# Altium schematic sheet PCB_Michka_Ver0101.SchDoc
size A1
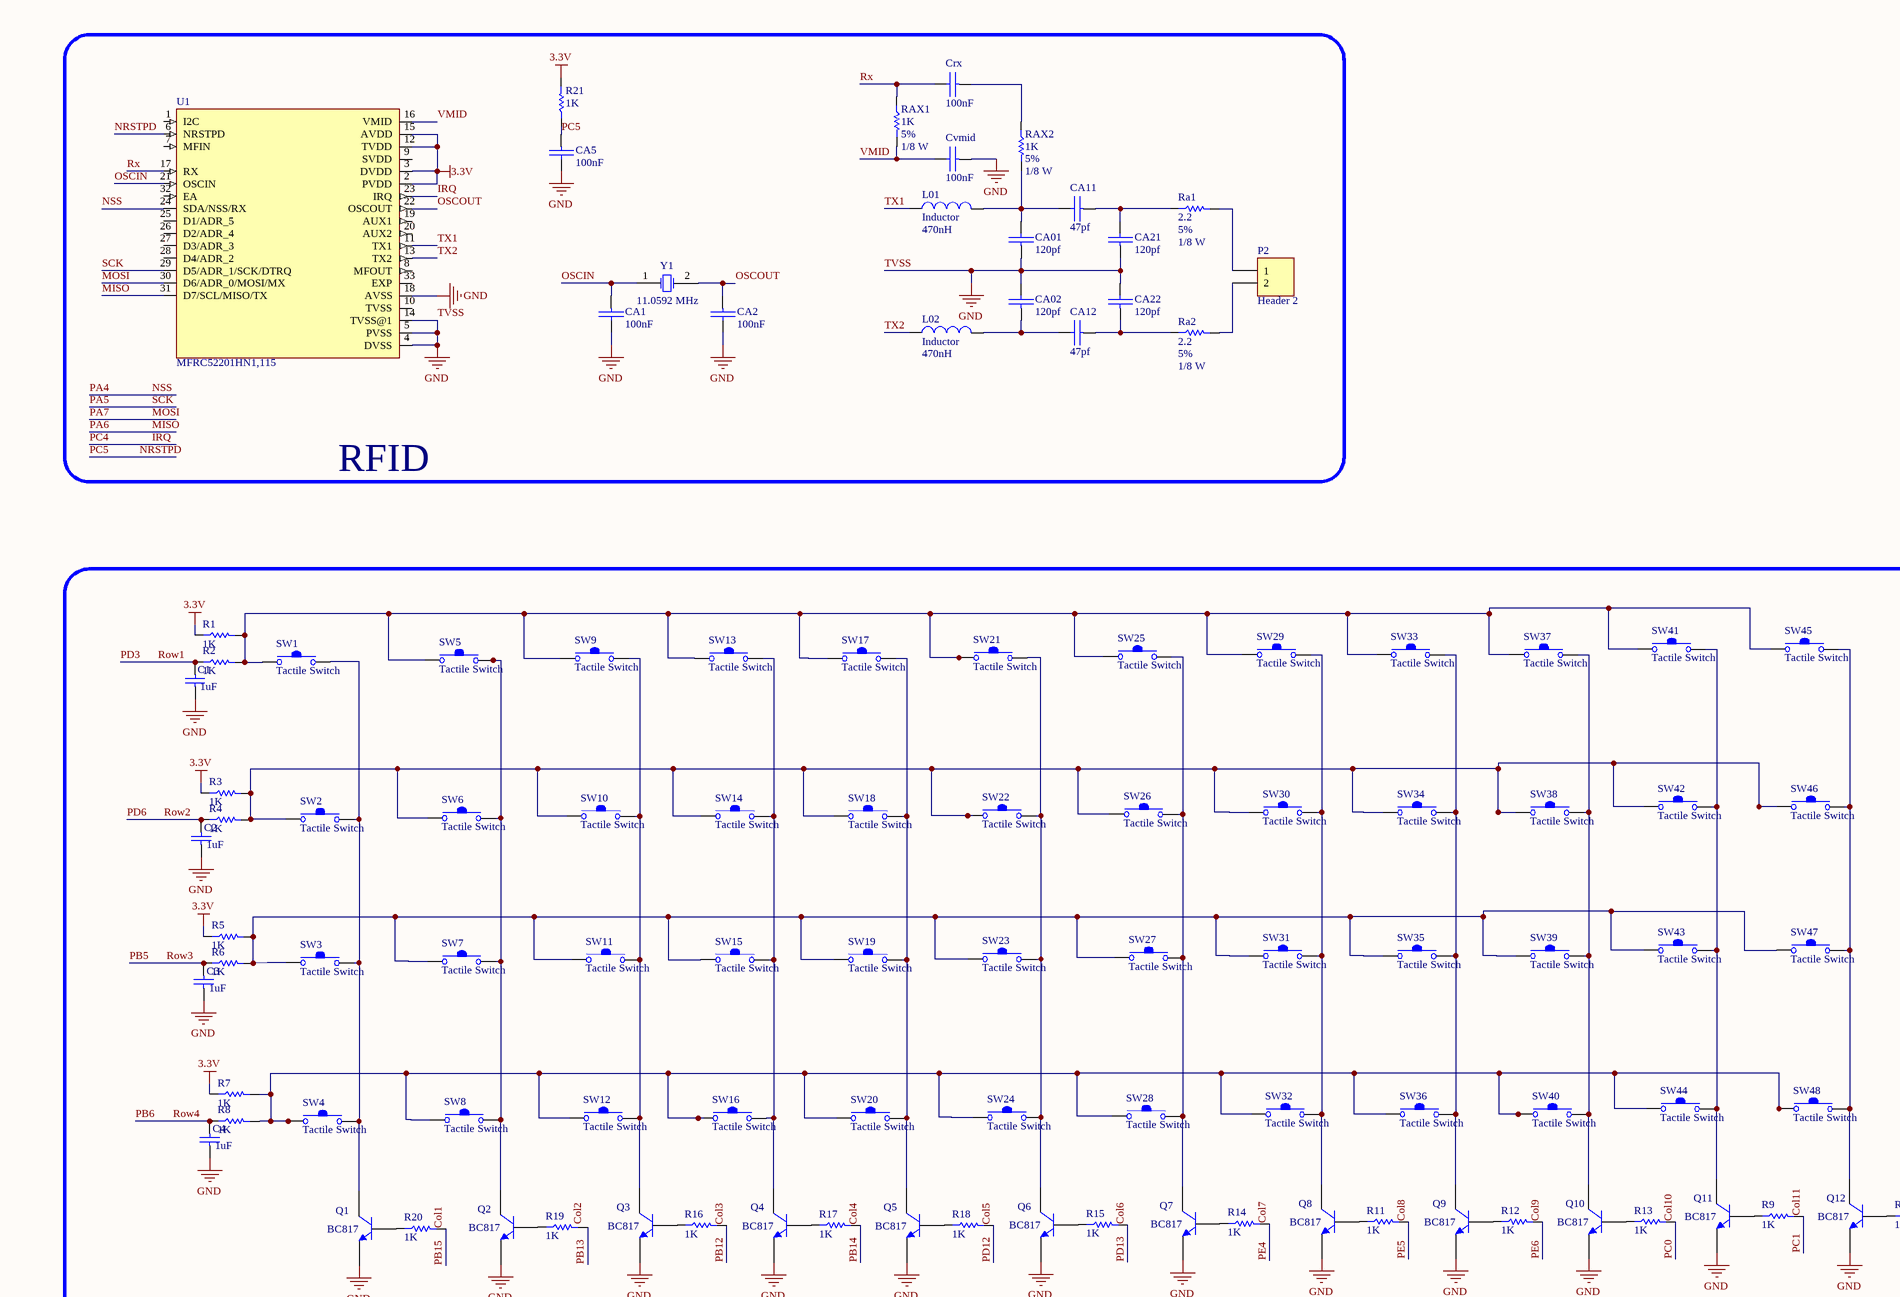
[diagram p0: PCB_Michka_Ver0101.SchDoc, top left]
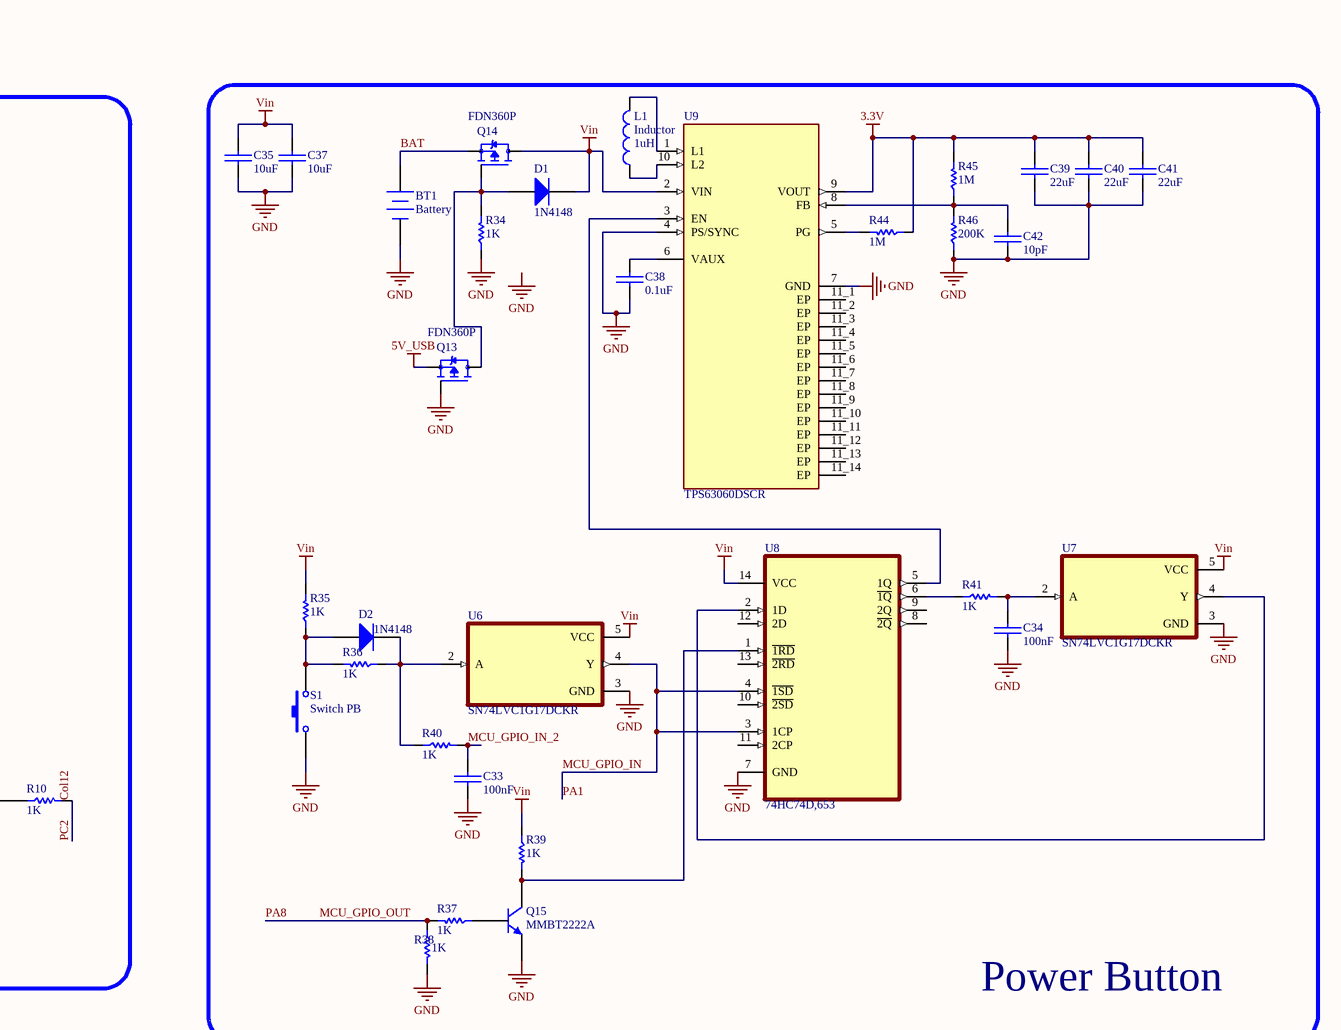
[diagram p1: PCB_Michka_Ver0101.SchDoc, top right]
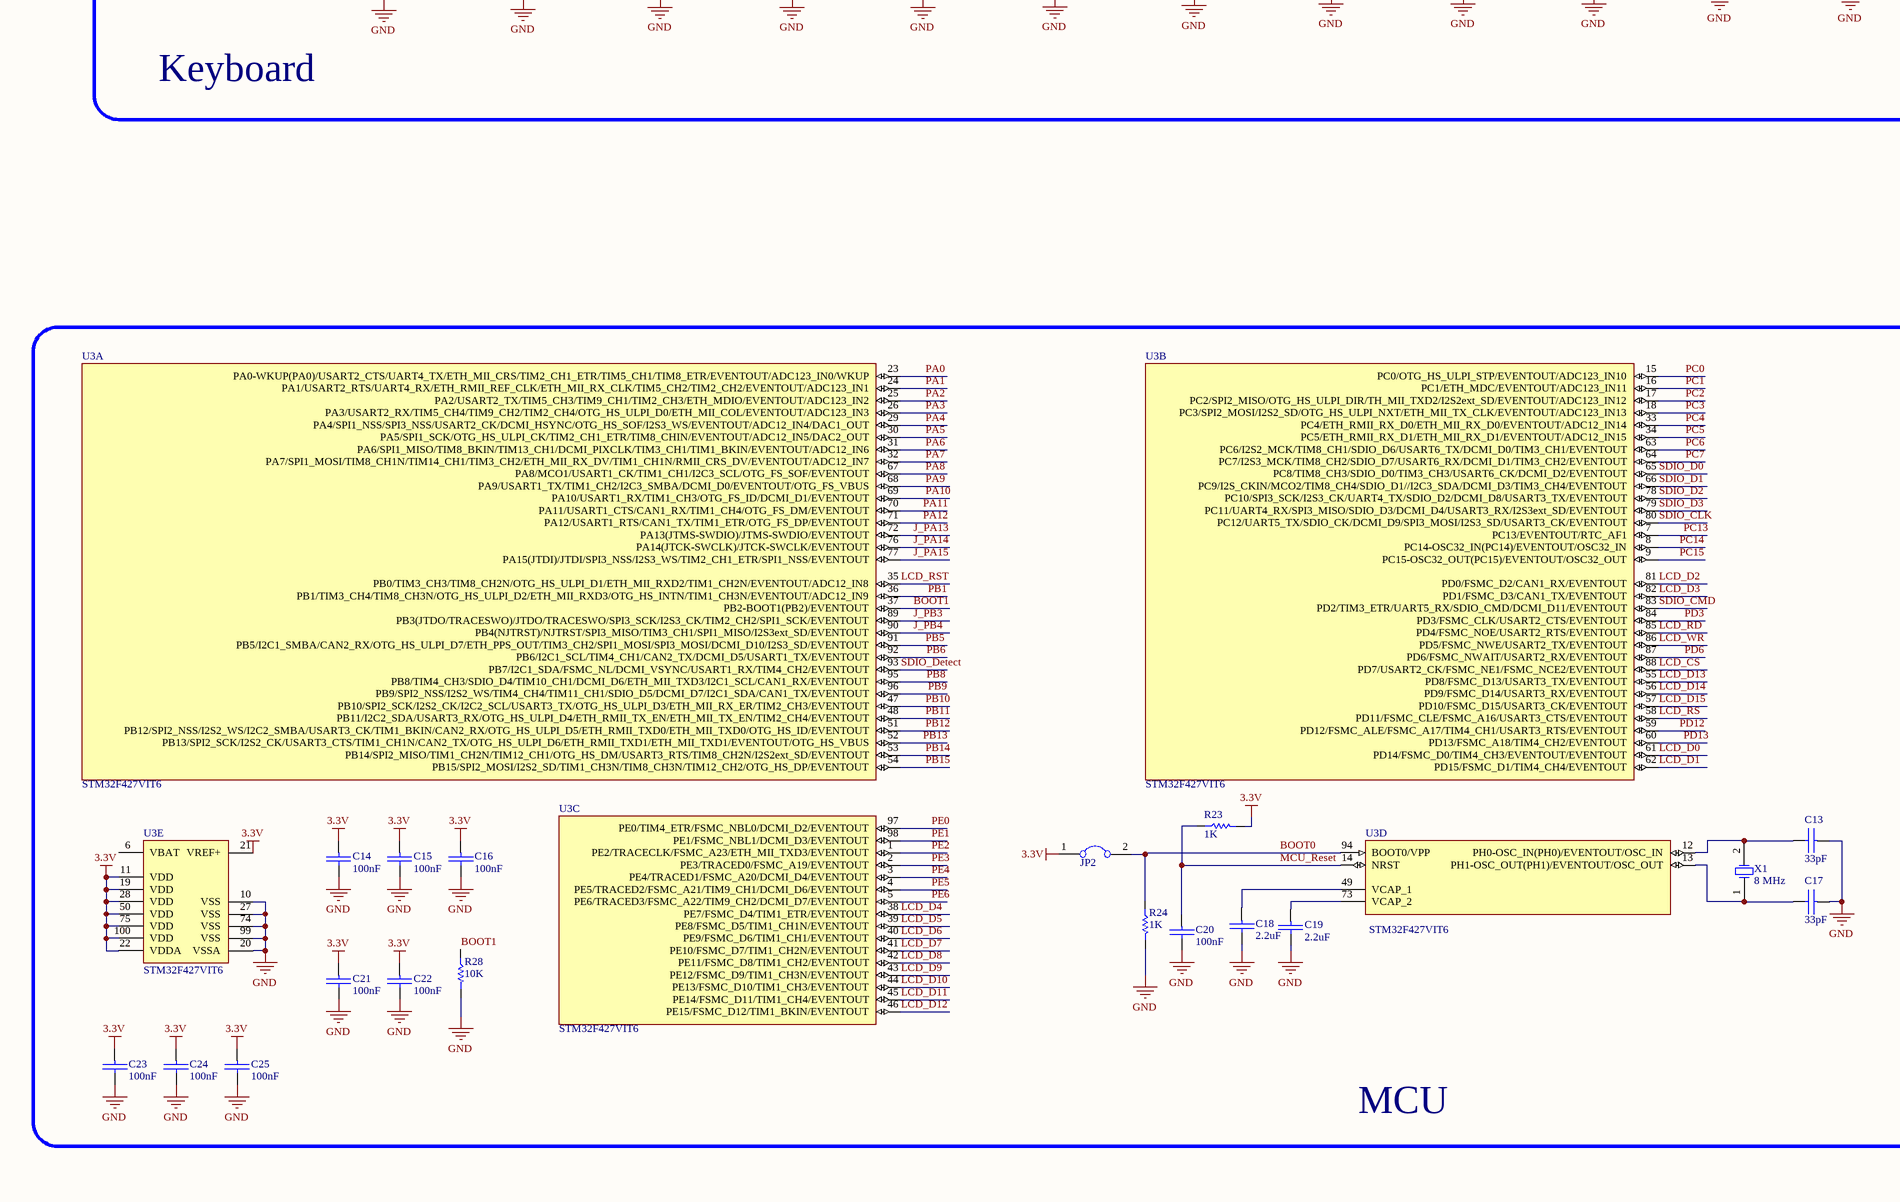
[diagram p2: PCB_Michka_Ver0101.SchDoc, bottom left]
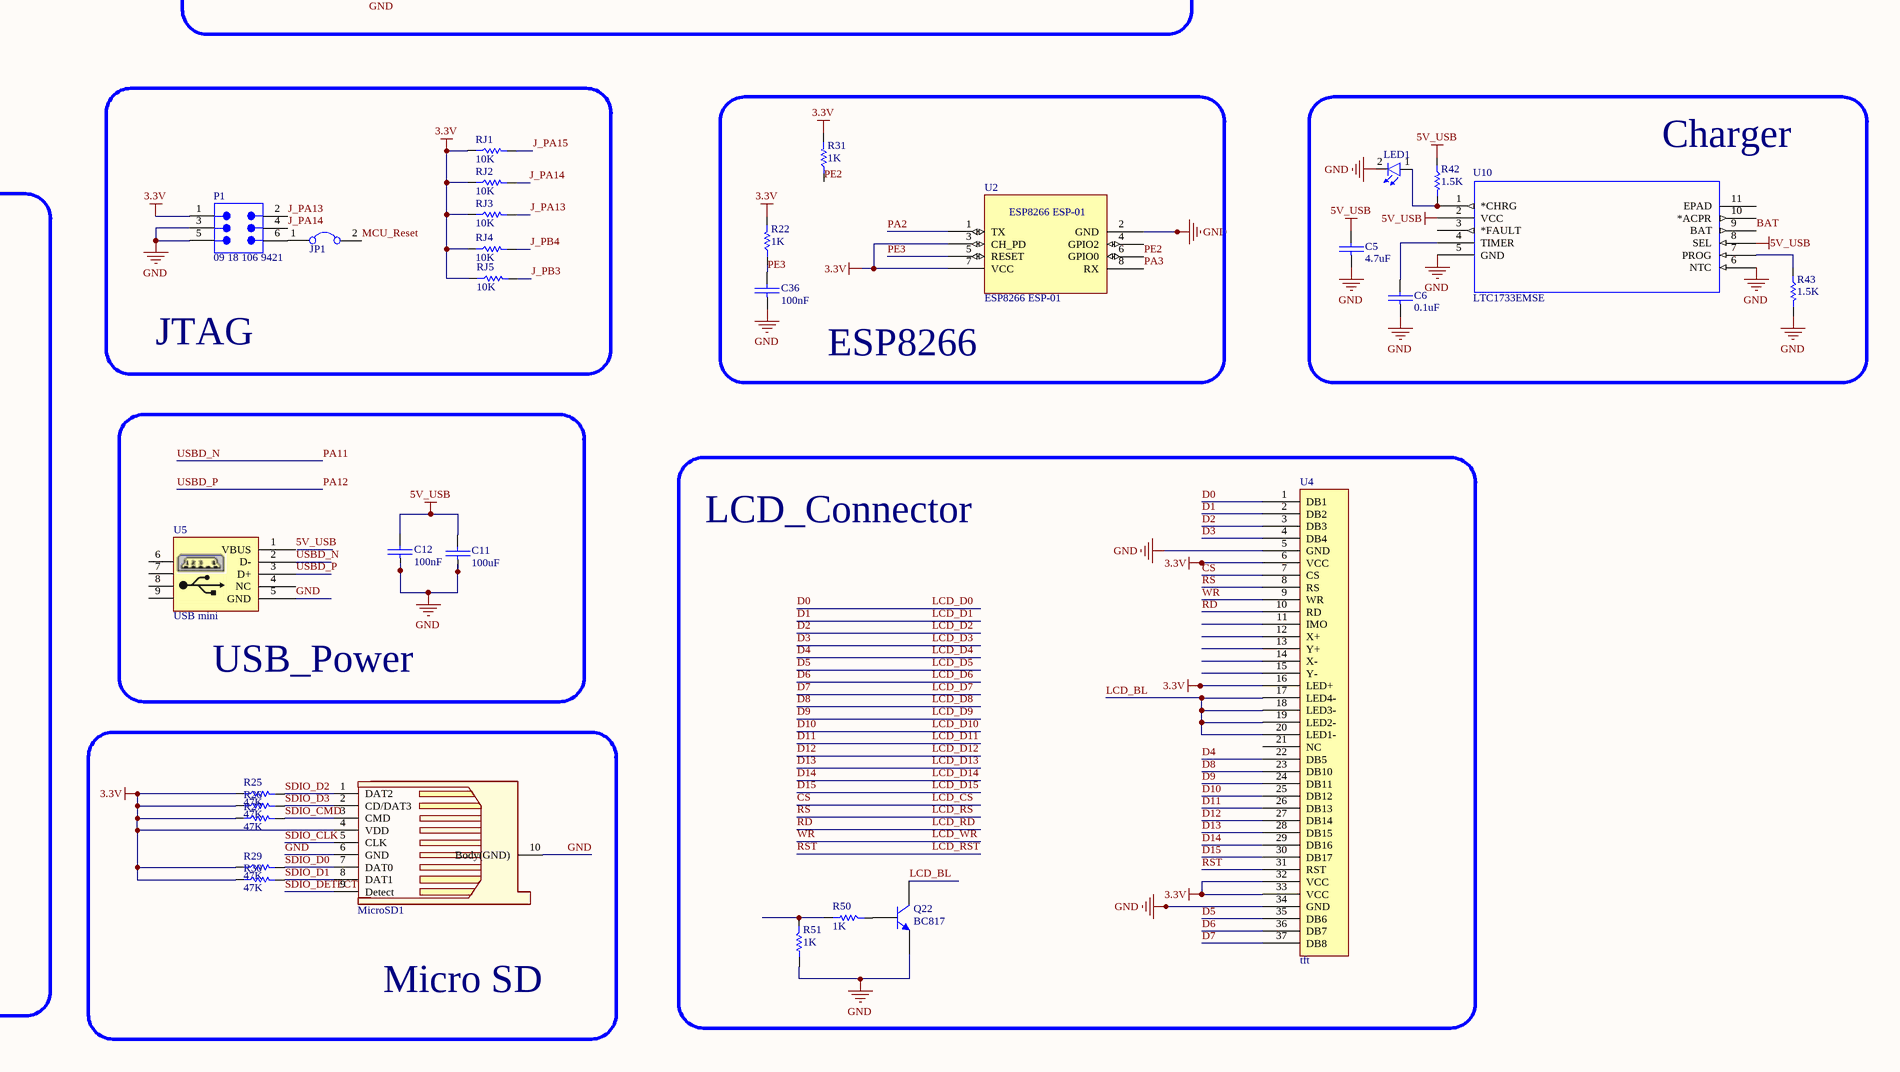
[diagram p3: PCB_Michka_Ver0101.SchDoc, bottom right]

## Parts
BT1  Battery  [BAT-2]
C1  1uF  [SMD_CAP_1206]
C2  1uF  [SMD_CAP_1206]
C3  1uF  [SMD_CAP_1206]
C4  1uF  [SMD_CAP_1206]
C5  4.7uF  [SMD_CAP_1206]
C6  0.1uF  [SMD_CAP_1206]
C11  100uF  [CAP 1206 (3216X15L)]
C12  100nF  [SMD_CAP_1206]
C13  33pF  [SMD_CAP_1206]
C14  100nF  [SMD_CAP_1206]
C15  100nF  [SMD_CAP_1206]
C16  100nF  [SMD_CAP_1206]
C17  33pF  [SMD_CAP_1206]
C18  2.2uF  [SMD_CAP_1206]
C19  2.2uF  [SMD_CAP_1206]
C20  100nF  [SMD_CAP_1206]
C21  100nF  [SMD_CAP_1206]
C22  100nF  [SMD_CAP_1206]
C23  100nF  [SMD_CAP_1206]
C24  100nF  [SMD_CAP_1206]
C25  100nF  [SMD_CAP_1206]
C33  100nF  [SMD_CAP_1206]
C34  100nF  [SMD_CAP_1206]
C35  10uF  [SMD_CAP_1206]
C36  100nF  [SMD_CAP_1206]
C37  10uF  [SMD_CAP_1206]
C38  0.1uF  [SMD_CAP_1206]
C39  22uF  [SMD_CAP_1206]
C40  22uF  [SMD_CAP_1206]
C41  22uF  [SMD_CAP_1206]
C42  10pF  [SMD_CAP_1206]
CA01  120pf  [SMD_CAP_1206]
CA1  100nF  [SMD_CAP_1206]
CA02  120pf  [SMD_CAP_1206]
CA2  100nF  [SMD_CAP_1206]
CA5  100nF  [SMD_CAP_1206]
CA11  47pf  [SMD_CAP_1206]
CA12  47pf  [SMD_CAP_1206]
CA21  120pf  [SMD_CAP_1206]
CA22  120pf  [SMD_CAP_1206]
Crx  100nF  [SMD_CAP_1206]
Cvmid  100nF  [SMD_CAP_1206]
D1  1N4148  [LL4148]
D2  1N4148  [LL4148]
JP1  Jumper  [Jumper Small - 2.54 - GRAY]  (value not drawn)
JP2  Jumper  [Jumper Small - 2.54 - GRAY]  (value not drawn)
L01  Inductor  value 470nH  [INDC1608L]
L1  Inductor  value 1uH  [INDC4532]
L02  Inductor  value 470nH  [INDC1608L]
LED1  Red  [LED SMD 1206]  (value not drawn)
MicroSD1  MicroSD Socket  [MicroSD_Socket]  (value not drawn)
P1  09 18 106 9421  [9181069421]
P2  Header 2  [HDR1X2]
Q1  BC817  [SOT23_BEC_N]
Q2  BC817  [SOT23_BEC_N]
Q3  BC817  [SOT23_BEC_N]
Q4  BC817  [SOT23_BEC_N]
Q5  BC817  [SOT23_BEC_N]
Q6  BC817  [SOT23_BEC_N]
Q7  BC817  [SOT23_BEC_N]
Q8  BC817  [SOT23_BEC_N]
Q9  BC817  [SOT23_BEC_N]
Q10  BC817  [SOT23_BEC_N]
Q11  BC817  [SOT23_BEC_N]
Q12  BC817  [SOT23_BEC_N]
Q13  FDN360P  [SOT95P251X112-3N]
Q14  FDN360P  [SOT95P251X112-3N]
Q15  MMBT2222A  [SOT23_BEC_N]
Q22  BC817  [SOT23_BEC_N]
R1  1K  [SMD_RES_1206]
R2  1K  [SMD_RES_1206]
R3  1K  [SMD_RES_1206]
R4  1K  [SMD_RES_1206]
R5  1K  [SMD_RES_1206]
R6  1K  [SMD_RES_1206]
R7  1K  [SMD_RES_1206]
R8  1K  [SMD_RES_1206]
R9  1K  [SMD_RES_1206]
R10  1K  [SMD_RES_1206]
R11  1K  [SMD_RES_1206]
R12  1K  [SMD_RES_1206]
R13  1K  [SMD_RES_1206]
R14  1K  [SMD_RES_1206]
R15  1K  [SMD_RES_1206]
R16  1K  [SMD_RES_1206]
R17  1K  [SMD_RES_1206]
R18  1K  [SMD_RES_1206]
R19  1K  [SMD_RES_1206]
R20  1K  [SMD_RES_1206]
R21  value 1K  [SMD_RES_1206]  (hidden comment: 10k)
R22  value 1K  [SMD_RES_1206]  (hidden comment: 10k)
R23  value 1K  [SMD_RES_1206]  (hidden comment: 10k)
R24  1K  [SMD_RES_1206]
R25  47K  [SMD_RES_1206]
R26  47K  [SMD_RES_1206]
R27  47K  [SMD_RES_1206]
R28  10K  [SMD_RES_1206]
R29  47K  [SMD_RES_1206]
R30  47K  [SMD_RES_1206]
R31  value 1K  [SMD_RES_1206]  (hidden comment: 10k)
R34  1K  [RES 1206 (3216X08L)]
R35  1K  [RES 1206 (3216X08L)]
R36  1K  [RES 1206 (3216X08L)]
R37  1K  [RES 1206 (3216X08L)]
R38  1K  [RES 1206 (3216X08L)]
R39  1K  [RES 1206 (3216X08L)]
R40  1K  [RES 1206 (3216X08L)]
R41  1K  [RES 1206 (3216X08L)]
R42  1.5K  [RES 1206 (3216X08L)]
R43  1.5K  [RES 1206 (3216X08L)]
R44  1M  [RES 1206 (3216X08L)]
R45  1M  [RES 1206 (3216X08L)]
R46  200K  [RES 1206 (3216X08L)]
R50  1K  [SMD_RES_1206]
R51  1K  [SMD_RES_1206]
Ra1  Tolerance: 5%  Power: 1/8 W  [RES 1206 (3216X08L)]  (hidden comment: 2.2)
Ra2  Tolerance: 5%  Power: 1/8 W  [RES 1206 (3216X08L)]  (hidden comment: 2.2)
RAX1  Tolerance: 5%  Power: 1/8 W  [RES 1206 (3216X08L)]  (hidden comment: 1K)
RAX2  Tolerance: 5%  Power: 1/8 W  [RES 1206 (3216X08L)]  (hidden comment: 1K)
RJ1  10K  [SMD_RES_1206]
RJ2  10K  [SMD_RES_1206]
RJ3  10K  [SMD_RES_1206]
RJ4  10K  [SMD_RES_1206]
RJ5  10K  [SMD_RES_1206]
S1  Switch PB  [Switch - Push to On]
SW1  Tactile Switch  [Tactile_Switch]
SW2  Tactile Switch  [Tactile_Switch]
SW3  Tactile Switch  [Tactile_Switch]
SW4  Tactile Switch  [Tactile_Switch]
SW5  Tactile Switch  [Tactile_Switch]
SW6  Tactile Switch  [Tactile_Switch]
SW7  Tactile Switch  [Tactile_Switch]
SW8  Tactile Switch  [Tactile_Switch]
SW9  Tactile Switch  [Tactile_Switch]
SW10  Tactile Switch  [Tactile_Switch]
SW11  Tactile Switch  [Tactile_Switch]
SW12  Tactile Switch  [Tactile_Switch]
SW13  Tactile Switch  [Tactile_Switch]
SW14  Tactile Switch  [Tactile_Switch]
SW15  Tactile Switch  [Tactile_Switch]
SW16  Tactile Switch  [Tactile_Switch]
SW17  Tactile Switch  [Tactile_Switch]
SW18  Tactile Switch  [Tactile_Switch]
SW19  Tactile Switch  [Tactile_Switch]
SW20  Tactile Switch  [Tactile_Switch]
SW21  Tactile Switch  [Tactile_Switch]
SW22  Tactile Switch  [Tactile_Switch]
SW23  Tactile Switch  [Tactile_Switch]
SW24  Tactile Switch  [Tactile_Switch]
SW25  Tactile Switch  [Tactile_Switch]
SW26  Tactile Switch  [Tactile_Switch]
SW27  Tactile Switch  [Tactile_Switch]
SW28  Tactile Switch  [Tactile_Switch]
SW29  Tactile Switch  [Tactile_Switch]
SW30  Tactile Switch  [Tactile_Switch]
SW31  Tactile Switch  [Tactile_Switch]
SW32  Tactile Switch  [Tactile_Switch]
SW33  Tactile Switch  [Tactile_Switch]
SW34  Tactile Switch  [Tactile_Switch]
SW35  Tactile Switch  [Tactile_Switch]
SW36  Tactile Switch  [Tactile_Switch]
SW37  Tactile Switch  [Tactile_Switch]
SW38  Tactile Switch  [Tactile_Switch]
SW39  Tactile Switch  [Tactile_Switch]
SW40  Tactile Switch  [Tactile_Switch]
SW41  Tactile Switch  [Tactile_Switch]
SW42  Tactile Switch  [Tactile_Switch]
SW43  Tactile Switch  [Tactile_Switch]
SW44  Tactile Switch  [Tactile_Switch]
SW45  Tactile Switch  [Tactile_Switch]
SW46  Tactile Switch  [Tactile_Switch]
SW47  Tactile Switch  [Tactile_Switch]
SW48  Tactile Switch  [Tactile_Switch]
U1  MFRC52201HN1,115  [QFN50P500X500X100-33N]
U2  ESP8266 ESP-01  [ESP8266_ESP_01_Footprint]
U3  STM32F427VIT6  [LQFP176_M]  (parts A,B,C,D,E of 5)
U4  tft  [LCD_2_4_KavirElec]
U5  USB mini  [mini USB Connector]
U6  SN74LVC1G17DCKR  [SOT65P210X110-5N]
U7  SN74LVC1G17DCKR  [SOT65P210X110-5N]
U8  74HC74D,653  [SOIC127P600X175-14N]
U9  TPS63060DSCR  [CONV_TPS63060DSCR]
U10  LTC1733EMSE  [MSOP-10_MSE]
X1  8 MHz  [XTAL Small]
Y1  11.0592 MHz  [XTAL Small]

## Blocks framed on the sheet
RFID: CA01 CA1 CA02 CA2 CA5 CA11 CA12 CA21 CA22 Crx Cvmid L01 L02 P2 R21 Ra1 Ra2 RAX1 RAX2 U1 Y1
Keyboard: C1-C4 Q1-Q12 R1-R20 SW1-SW48
Power Button: BT1 C33-C35 C37-C42 D1 D2 L1 Q13-Q15 R34-R41 R44-R46 S1 U6-U9
JTAG: JP1 P1 RJ1-RJ5
ESP8266: C36 R22 R31 U2
Charger: C5 C6 LED1 R42 R43 U10
MCU: C13-C25 JP2 R23 R24 R28 U3 X1
USB_Power: C11 C12 U5
LCD_Connector: Q22 R50 R51 U4
Micro SD: MicroSD1 R25-R27 R29 R30

## Nets
3.3V: C14.2(-) C15.2(-) C16.2(-) C21.2(-) C22.2(-) C23.2(-) C24.2(-) C25.2(-) C39.1(+) C40.1(+) C41.1(+) JP2.1 MicroSD1.4(VDD) P1.1 R1.1 R3.1 R5.1 R7.1 R21.2 R22.2 R23.2 R25.1 R26.1 R27.1 R29.1 R30.1 R31.2 R44.1 R45.2 RJ1.1 RJ2.1 RJ3.1 RJ4.1 RJ5.1 U1.2(PVDD) U1.3(DVDD) U1.12(TVDD) U1.15(AVDD) U2.3(CH_PD) U2.7(VCC) U3.11(VDD) U3.19(VDD) U3.21(VREF+) U3.22(VDDA) U3.28(VDD) U3.50(VDD) U3.75(VDD) U3.100(VDD) U4.6(VCC) U4.16(LED+) U4.32(VCC) U4.33(VCC) U9.9(VOUT)
5V_USB: C5.1(+) C11.1(+) C12.1(+) Q13.2(S) R42.1 U5.1(VBUS) U10.2(VCC) U10.8(SEL)
GND: BT1.2(-) C1.1 C2.1 C3.1 C4.1 C5.2(-) C6.2(-) C11.2(-) C12.2(-) C13.2(-) C14.1(+) C15.1(+) C16.1(+) C17.2(-) C18.1(+) C19.1(+) C20.1(+) C21.1(+) C22.1(+) C23.1(+) C24.1(+) C25.1(+) C33.2(-) C34.2(-) C35.2(-) C36.2(-) C37.2(-) C38.2(-) C39.2(-) C40.2(-) C41.2(-) C42.2(-) CA1.1(+) CA01.2(-) CA02.1(+) CA2.1(+) CA5.1(+) CA21.2(-) CA22.1(+) Cvmid.2(-) LED1.2(K) MicroSD1.6(GND) MicroSD1.10(Body(GND)) P1.3 P1.5 Q1.2(E) Q2.2(E) Q3.2(E) Q4.2(E) Q5.2(E) Q6.2(E) Q7.2(E) Q8.2(E) Q9.2(E) Q10.2(E) Q11.2(E) Q12.2(E) Q13.1(G) Q15.2(E) Q22.2(E) R24.2 R28.2 R34.1 R38.2 R43.2 R46.1 R51.2 S1.1 U1.4(DVSS) U1.5(PVSS) U1.14(TVSS@1) U1.18(AVSS) U2.2(GND) U3.10(VSS) U3.20(VSSA) U3.27(VSS) U3.74(VSS) U3.99(VSS) U4.5(GND) U4.34(GND) U5.5(GND) U6.3(GND) U7.3(GND) U8.7(GND) U9.4(PS/SYNC) U9.7(GND) U10.5(GND) U10.6(NTC)  [also labelled TVSS]
Vin: C35.1(+) C37.1(+) D1.2(K) Q14.3(D) R35.2 R39.1 U6.5(VCC) U7.5(VCC) U8.14(VCC) U9.2(VIN)
BAT: BT1.1(+) Q14.2(S) U10.9(BAT)
BOOT0: JP2.2 R24.1 U3.94(BOOT0/VPP)
BOOT1: R28.1 U3.37(PB2-BOOT1(PB2)/EVENTOUT)
Col1: R20.2 U3.54(PB15/SPI2_MOSI/I2S2_SD/TIM1_CH3N/TIM8_CH3N/TIM12_CH2/OTG_HS_DP/EVENTOUT)  [also labelled PB15]
Col3: R16.2 U3.51(PB12/SPI2_NSS/I2S2_WS/I2C2_SMBA/USART3_CK/TIM1_BKIN/CAN2_RX/OTG_HS_ULPI_D5/ETH_RMII_TXD0/ETH_MII_TXD0/OTG_HS_ID/EVENTOUT)  [also labelled PB12]
Col4: R17.2 U3.53(PB14/SPI2_MISO/TIM1_CH2N/TIM12_CH1/OTG_HS_DM/USART3_RTS/TIM8_CH2N/I2S2ext_SD/EVENTOUT)  [also labelled PB14]
Col5: R18.2 U3.59(PD12/FSMC_ALE/FSMC_A17/TIM4_CH1/USART3_RTS/EVENTOUT)  [also labelled PD12]
Col6: R15.2 U3.60(PD13/FSMC_A18/TIM4_CH2/EVENTOUT)  [also labelled PD13]
Col7: R14.2 U3.3(PE4/TRACED1/FSMC_A20/DCMI_D4/EVENTOUT)  [also labelled PE4]
Col8: R11.2 U3.4(PE5/TRACED2/FSMC_A21/TIM9_CH1/DCMI_D6/EVENTOUT)  [also labelled PE5]
Col9: R12.2 U3.5(PE6/TRACED3/FSMC_A22/TIM9_CH2/DCMI_D7/EVENTOUT)  [also labelled PE6]
Col10: R13.2 U3.15(PC0/OTG_HS_ULPI_STP/EVENTOUT/ADC123_IN10)  [also labelled PC0]
Col11: R9.2 U3.16(PC1/ETH_MDC/EVENTOUT/ADC123_IN11)  [also labelled PC1]
Col12: R10.2 U3.17(PC2/SPI2_MISO/OTG_HS_ULPI_DIR/TH_MII_TXD2/I2S2ext_SD/EVENTOUT/ADC123_IN12)  [also labelled PC2]
CS: U3.88(PD7/USART2_CK/FSMC_NE1/FSMC_NCE2/EVENTOUT) U4.7(CS)  [also labelled LCD_CS]
D0: U3.61(PD14/FSMC_D0/TIM4_CH3/EVENTOUT/EVENTOUT) U4.1(DB1)  [also labelled LCD_D0]
D1: U3.62(PD15/FSMC_D1/TIM4_CH4/EVENTOUT) U4.2(DB2)  [also labelled LCD_D1]
D2: U3.81(PD0/FSMC_D2/CAN1_RX/EVENTOUT) U4.3(DB3)  [also labelled LCD_D2]
D3: U3.82(PD1/FSMC_D3/CAN1_TX/EVENTOUT) U4.4(DB4)  [also labelled LCD_D3]
D4: U3.38(PE7/FSMC_D4/TIM1_ETR/EVENTOUT) U4.22(DB5)  [also labelled LCD_D4]
D5: U3.39(PE8/FSMC_D5/TIM1_CH1N/EVENTOUT) U4.35(DB6)  [also labelled LCD_D5]
D6: U3.40(PE9/FSMC_D6/TIM1_CH1/EVENTOUT) U4.36(DB7)  [also labelled LCD_D6]
D7: U3.41(PE10/FSMC_D7/TIM1_CH2N/EVENTOUT) U4.37(DB8)  [also labelled LCD_D7]
D8: U3.42(PE11/FSMC_D8/TIM1_CH2/EVENTOUT) U4.23(DB10)  [also labelled LCD_D8]
D9: U3.43(PE12/FSMC_D9/TIM1_CH3N/EVENTOUT) U4.24(DB11)  [also labelled LCD_D9]
D10: U3.44(PE13/FSMC_D10/TIM1_CH3/EVENTOUT) U4.25(DB12)  [also labelled LCD_D10]
D11: U3.45(PE14/FSMC_D11/TIM1_CH4/EVENTOUT) U4.26(DB13)  [also labelled LCD_D11]
D12: U3.46(PE15/FSMC_D12/TIM1_BKIN/EVENTOUT) U4.27(DB14)  [also labelled LCD_D12]
D13: U3.55(PD8/FSMC_D13/USART3_TX/EVENTOUT) U4.28(DB15)  [also labelled LCD_D13]
D14: U3.56(PD9/FSMC_D14/USART3_RX/EVENTOUT) U4.29(DB16)  [also labelled LCD_D14]
D15: U3.57(PD10/FSMC_D15/USART3_CK/EVENTOUT) U4.30(DB17)  [also labelled LCD_D15]
IRQ: U1.23(IRQ) U3.33(PC4/ETH_RMII_RX_D0/ETH_MII_RX_D0/EVENTOUT/ADC12_IN14)  [also labelled PC4]
J_PA13: P1.2 RJ3.2 U3.72(PA13(JTMS-SWDIO)/JTMS-SWDIO/EVENTOUT)
J_PA14: P1.4 RJ2.2 U3.76(PA14(JTCK-SWCLK)/JTCK-SWCLK/EVENTOUT)
J_PA15: RJ1.2 U3.77(PA15(JTDI)/JTDI/SPI3_NSS/I2S3_WS/TIM2_CH1_ETR/SPI1_NSS/EVENTOUT)
J_PB3: RJ5.2 U3.89(PB3(JTDO/TRACESWO)/JTDO/TRACESWO/SPI3_SCK/I2S3_CK/TIM2_CH2/SPI1_SCK/EVENTOUT)
J_PB4: RJ4.2 U3.90(PB4(NJTRST)/NJTRST/SPI3_MISO/TIM3_CH1/SPI1_MISO/I2S3ext_SD/EVENTOUT)
LCD_BL: Q22.3(C) U4.17(LED4-) U4.18(LED3-) U4.19(LED2-) U4.20(LED1-)
LCD_RD: U3.85(PD4/FSMC_NOE/USART2_RTS/EVENTOUT) U4.10(RD)  [also labelled RD]
LCD_RS: U3.58(PD11/FSMC_CLE/FSMC_A16/USART3_CTS/EVENTOUT) U4.8(RS)  [also labelled RS]
LCD_RST: U3.35(PB0/TIM3_CH3/TIM8_CH2N/OTG_HS_ULPI_D1/ETH_MII_RXD2/TIM1_CH2N/EVENTOUT/ADC12_IN8) U4.31(RST)  [also labelled RST]
LCD_WR: U3.86(PD5/FSMC_NWE/USART2_TX/EVENTOUT) U4.9(WR)  [also labelled WR]
MCU_GPIO_IN: U3.24(PA1/USART2_RTS/UART4_RX/ETH_RMII_REF_CLK/ETH_MII_RX_CLK/TIM5_CH2/TIM2_CH2/EVENTOUT/ADC123_IN1) U6.4(Y) U8.3(1CP) U8.4(~{1SD})  [also labelled PA1]
MCU_GPIO_IN_2: C33.1(+) R40.2
MCU_GPIO_OUT: R37.2 R38.1 U3.67(PA8/MCO1/USART1_CK/TIM1_CH1/I2C3_SCL/OTG_FS_SOF/EVENTOUT)  [also labelled PA8]
MCU_Reset: C20.2(-) JP1.2 R23.1 U3.14(NRST)
MISO: U1.31(D7/SCL/MISO/TX) U3.31(PA6/SPI1_MISO/TIM8_BKIN/TIM13_CH1/DCMI_PIXCLK/TIM3_CH1/TIM1_BKIN/EVENTOUT/ADC12_IN6)  [also labelled PA6]
MOSI: U1.30(D6/ADR_0/MOSI/MX) U3.32(PA7/SPI1_MOSI/TIM8_CH1N/TIM14_CH1/TIM3_CH2/ETH_MII_RX_DV/TIM1_CH1N/RMII_CRS_DV/EVENTOUT/ADC12_IN7)  [also labelled PA7]
NRSTPD: CA5.2(-) R21.1 U1.6(NRSTPD) U3.34(PC5/ETH_RMII_RX_D1/ETH_MII_RX_D1/EVENTOUT/ADC12_IN15)  [also labelled PC5]
NSS: U1.24(SDA/NSS/RX) U3.29(PA4/SPI1_NSS/SPI3_NSS/USART2_CK/DCMI_HSYNC/OTG_HS_SOF/I2S3_WS/EVENTOUT/ADC12_IN4/DAC1_OUT)  [also labelled PA4]
OSCIN: CA1.2(-) U1.21(OSCIN) Y1.1(OSC1)
OSCOUT: CA2.2(-) U1.22(OSCOUT) Y1.2(OSC2)
PA0: U3.23(PA0-WKUP(PA0)/USART2_CTS/UART4_TX/ETH_MII_CRS/TIM2_CH1_ETR/TIM5_CH1/TIM8_ETR/EVENTOUT/ADC123_IN0/WKUP)
PA2: U2.1(TX) U3.25(PA2/USART2_TX/TIM5_CH3/TIM9_CH1/TIM2_CH3/ETH_MDIO/EVENTOUT/ADC123_IN2)
PA3: U2.8(RX) U3.26(PA3/USART2_RX/TIM5_CH4/TIM9_CH2/TIM2_CH4/OTG_HS_ULPI_D0/ETH_MII_COL/EVENTOUT/ADC123_IN3)
PA5: U1.29(D5/ADR_1/SCK/DTRQ) U3.30(PA5/SPI1_SCK/OTG_HS_ULPI_CK/TIM2_CH1_ETR/TIM8_CHIN/EVENTOUT/ADC12_IN5/DAC2_OUT)  [also labelled SCK]
PA9: U3.68(PA9/USART1_TX/TIM1_CH2/I2C3_SMBA/DCMI_D0/EVENTOUT/OTG_FS_VBUS)
PA10: U3.69(PA10/USART1_RX/TIM1_CH3/OTG_FS_ID/DCMI_D1/EVENTOUT)
PA11: U3.70(PA11/USART1_CTS/CAN1_RX/TIM1_CH4/OTG_FS_DM/EVENTOUT) U5.2(D-)  [also labelled USBD_N]
PA12: U3.71(PA12/USART1_RTS/CAN1_TX/TIM1_ETR/OTG_FS_DP/EVENTOUT) U5.3(D+)  [also labelled USBD_P]
PB1: U3.36(PB1/TIM3_CH4/TIM8_CH3N/OTG_HS_ULPI_D2/ETH_MII_RXD3/OTG_HS_INTN/TIM1_CH3N/EVENTOUT/ADC12_IN9)
PB5: C3.2 R6.1 U3.91(PB5/I2C1_SMBA/CAN2_RX/OTG_HS_ULPI_D7/ETH_PPS_OUT/TIM3_CH2/SPI1_MOSI/SPI3_MOSI/DCMI_D10/I2S3_SD/EVENTOUT)  [also labelled Row3]
PB6: C4.2 R8.1 U3.92(PB6/I2C1_SCL/TIM4_CH1/CAN2_TX/DCMI_D5/USART1_TX/EVENTOUT)  [also labelled Row4]
PB8: U3.95(PB8/TIM4_CH3/SDIO_D4/TIM10_CH1/DCMI_D6/ETH_MII_TXD3/I2C1_SCL/CAN1_RX/EVENTOUT)
PB9: U3.96(PB9/SPI2_NSS/I2S2_WS/TIM4_CH4/TIM11_CH1/SDIO_D5/DCMI_D7/I2C1_SDA/CAN1_TX/EVENTOUT)
PB10: U3.47(PB10/SPI2_SCK/I2S2_CK/I2C2_SCL/USART3_TX/OTG_HS_ULPI_D3/ETH_MII_RX_ER/TIM2_CH3/EVENTOUT)
PB11: U3.48(PB11/I2C2_SDA/USART3_RX/OTG_HS_ULPI_D4/ETH_RMII_TX_EN/ETH_MII_TX_EN/TIM2_CH4/EVENTOUT)
PB13: R19.2 U3.52(PB13/SPI2_SCK/I2S2_CK/USART3_CTS/TIM1_CH1N/CAN2_TX/OTG_HS_ULPI_D6/ETH_RMII_TXD1/ETH_MII_TXD1/EVENTOUT/OTG_HS_VBUS)
PC3: U3.18(PC3/SPI2_MOSI/I2S2_SD/OTG_HS_ULPI_NXT/ETH_MII_TX_CLK/EVENTOUT/ADC123_IN13)
PC6: U3.63(PC6/I2S2_MCK/TIM8_CH1/SDIO_D6/USART6_TX/DCMI_D0/TIM3_CH1/EVENTOUT)
PC7: U3.64(PC7/I2S3_MCK/TIM8_CH2/SDIO_D7/USART6_RX/DCMI_D1/TIM3_CH2/EVENTOUT)
PC13: U3.7(PC13/EVENTOUT/RTC_AF1)
PC14: U3.8(PC14-OSC32_IN(PC14)/EVENTOUT/OSC32_IN)
PC15: U3.9(PC15-OSC32_OUT(PC15)/EVENTOUT/OSC32_OUT)
PD3: C1.2 R2.1 U3.84(PD3/FSMC_CLK/USART2_CTS/EVENTOUT)  [also labelled Row1]
PD6: C2.2 R4.1 U3.87(PD6/FSMC_NWAIT/USART2_RX/EVENTOUT)  [also labelled Row2]
PE0: U3.97(PE0/TIM4_ETR/FSMC_NBL0/DCMI_D2/EVENTOUT)
PE1: U3.98(PE1/FSMC_NBL1/DCMI_D3/EVENTOUT)
PE2: R31.1 U2.6(GPIO0) U3.1(PE2/TRACECLK/FSMC_A23/ETH_MII_TXD3/EVENTOUT)
PE3: C36.1(+) R22.1 U2.5(RESET) U3.2(PE3/TRACED0/FSMC_A19/EVENTOUT)
Rx: Crx.1(+) RAX1.1 U1.17(RX)
SDIO_CLK: MicroSD1.5(CLK) U3.80(PC12/UART5_TX/SDIO_CK/DCMI_D9/SPI3_MOSI/I2S3_SD/USART3_CK/EVENTOUT)
SDIO_CMD: MicroSD1.3(CMD) R27.2 U3.83(PD2/TIM3_ETR/UART5_RX/SDIO_CMD/DCMI_D11/EVENTOUT)
SDIO_D0: MicroSD1.7(DAT0) R29.2 U3.65(PC8/TIM8_CH3/SDIO_D0/TIM3_CH3/USART6_CK/DCMI_D2/EVENTOUT)
SDIO_D1: MicroSD1.8(DAT1) R30.2 U3.66(PC9/I2S_CKIN/MCO2/TIM8_CH4/SDIO_D1//I2C3_SDA/DCMI_D3/TIM3_CH4/EVENTOUT)
SDIO_D2: MicroSD1.1(DAT2) R25.2 U3.78(PC10/SPI3_SCK/I2S3_CK/UART4_TX/SDIO_D2/DCMI_D8/USART3_TX/EVENTOUT)
SDIO_D3: MicroSD1.2(CD/DAT3) R26.2 U3.79(PC11/UART4_RX/SPI3_MISO/SDIO_D3/DCMI_D4/USART3_RX/I2S3ext_SD/EVENTOUT)
SDIO_Detect: MicroSD1.9(Detect) U3.93(PB7/I2C1_SDA/FSMC_NL/DCMI_VSYNC/USART1_RX/TIM4_CH2/EVENTOUT)
TX1: L01.1 U1.11(TX1)
TX2: L02.1 U1.13(TX2)
VMID: Cvmid.1(+) RAX1.2 U1.16(VMID)
NetC6_1: C6.1(+) U10.4(TIMER)
NetC13_1: C13.1(+) U3.12(PH0-OSC_IN(PH0)/EVENTOUT/OSC_IN) X1.2(OSC2)
NetC17_1: C17.1(+) U3.13(PH1-OSC_OUT(PH1)/EVENTOUT/OSC_OUT) X1.1(OSC1)
NetC18_2: C18.2(-) U3.49(VCAP_1)
NetC19_2: C19.2(-) U3.73(VCAP_2)
NetC34_1: C34.1(+) R41.2 U7.2(A)
NetC38_1: C38.1(+) U9.6(VAUX)
NetC42_1: C42.1(+) R45.1 R46.2 U9.8(FB)
NetCA01_1: CA01.1(+) CA11.1(+) L01.2 RAX2.2
NetCA02_2: CA02.2(-) CA12.1(+) L02.2
NetCA11_2: CA11.2(-) CA21.1(+) Ra1.1
NetCA12_2: CA12.2(-) CA22.2(-) Ra2.1
NetCrx_2: Crx.2(-) RAX2.1
NetD1_1: D1.1(A) Q13.3(D) Q14.1(G) R34.2
NetD2_1: D2.1(A) R35.1 R36.2 S1.2
NetD2_2: D2.2(K) R36.1 R40.1 U6.2(A)
NetJP1_1: JP1.1 P1.6
NetL1_1: L1.1 U9.10(L2)
NetL1_2: L1.2 U9.1(L1)
NetLED1_1: LED1.1(A) R42.2 U10.1(*CHRG)
NetP2_1: P2.1 Ra1.2
NetP2_2: P2.2 Ra2.2
NetQ1_1: Q1.1(B) R20.1
NetQ1_3: Q1.3(C) SW1.1 SW2.1 SW3.1 SW4.1
NetQ2_1: Q2.1(B) R19.1
NetQ2_3: Q2.3(C) SW5.1 SW6.1 SW7.1 SW8.1
NetQ3_1: Q3.1(B) R16.1
NetQ3_3: Q3.3(C) SW9.1 SW10.1 SW11.1 SW12.1
NetQ4_1: Q4.1(B) R17.1
NetQ4_3: Q4.3(C) SW13.1 SW14.1 SW15.1 SW16.1
NetQ5_1: Q5.1(B) R18.1
NetQ5_3: Q5.3(C) SW17.1 SW18.1 SW19.1 SW20.1
NetQ6_1: Q6.1(B) R15.1
NetQ6_3: Q6.3(C) SW21.1 SW22.1 SW23.1 SW24.1
NetQ7_1: Q7.1(B) R14.1
NetQ7_3: Q7.3(C) SW25.1 SW26.1 SW27.1 SW28.1
NetQ8_1: Q8.1(B) R11.1
NetQ8_3: Q8.3(C) SW29.1 SW30.1 SW31.1 SW32.1
NetQ9_1: Q9.1(B) R12.1
NetQ9_3: Q9.3(C) SW33.1 SW34.1 SW35.1 SW36.1
NetQ10_1: Q10.1(B) R13.1
NetQ10_3: Q10.3(C) SW37.1 SW38.1 SW39.1 SW40.1
NetQ11_1: Q11.1(B) R9.1
NetQ11_3: Q11.3(C) SW41.1 SW42.1 SW43.1 SW44.1
NetQ12_1: Q12.1(B) R10.1
NetQ12_3: Q12.3(C) SW45.1 SW46.1 SW47.1 SW48.1
NetQ15_1: Q15.1(B) R37.1
NetQ15_3: Q15.3(C) R39.2 U8.1(~{1RD})
NetQ22_1: Q22.1(B) R50.1
NetR1_2: R1.2 R2.2 SW1.0 SW5.0 SW9.0 SW13.0 SW17.0 SW21.0 SW25.0 SW29.0 SW33.0 SW37.0 SW41.0 SW45.0
NetR3_2: R3.2 R4.2 SW2.0 SW6.0 SW10.0 SW14.0 SW18.0 SW22.0 SW26.0 SW30.0 SW34.0 SW38.0 SW42.0 SW46.0
NetR5_2: R5.2 R6.2 SW3.0 SW7.0 SW11.0 SW15.0 SW19.0 SW23.0 SW27.0 SW31.0 SW35.0 SW39.0 SW43.0 SW47.0
NetR7_2: R7.2 R8.2 SW4.0 SW8.0 SW12.0 SW16.0 SW20.0 SW24.0 SW28.0 SW32.0 SW36.0 SW40.0 SW44.0 SW48.0
NetR41_1: R41.1 U8.6(~{1Q})
NetR43_1: R43.1 U10.7(PROG)
NetR44_2: R44.2 U9.5(PG)
NetR50_2: R50.2 R51.1
NetU7_4: U7.4(Y) U8.2(1D)
NetU8_5: U8.5(1Q) U9.3(EN)

Not connected (* = marked no-connect by the designer): U1 1(I2C) 7(MFIN) 8(MFOUT) 9(SVDD) 10(TVSS) 19(AUX1) 20(AUX2) 25(D1/ADR_5) 26(D2/ADR_4) 27(D3/ADR_3) 28(D4/ADR_2) 32(EA) 33(EXP); U2 4(GPIO2); U3 6(VBAT); U4 11(IMO) 12(X+) 13(Y+) 14(X-) 15(Y-) 21(NC); U5 4(NC) 6 7 8 9; U8 8(~{2Q}) 9(2Q) 10(~{2SD}) 11(2CP) 12(2D) 13(~{2RD}); U9 11_1(EP) 11_2(EP) 11_3(EP) 11_4(EP) 11_5(EP) 11_6(EP) 11_7(EP) 11_8(EP) 11_9(EP) 11_10(EP) 11_11(EP) 11_12(EP) 11_13(EP) 11_14(EP); U10 3(*FAULT) 10(*ACPR) 11(EPAD)

## Notes on the sheet
- Labels drawn without touching a wire or pin: Col2, GND

## Library data of the parts
BT1 = Battery: Multicell Battery; Published: 24-Mar-1999; LatestRevisionDate: 17-Jul-2002; LatestRevisionNote: Re-released for DXP Platform.; PackageReference: BAT-2; Publisher: Altium Limited; PackageDescription: Battery; 2 Leads
C1-C4 = Cap: Tantalium Capacitor; Voltage: 16V; Type: Tantalum Solid Electrolytic; Published: 8-Jun-2000; LatestRevisionDate: 17-Jul-2002; LatestRevisionNote: Re-released for DXP Platform.; PackageReference: RAD-0.3; Publisher: Altium Limited; PackageDescription: Radial Cap, Thru-Hole; 2 Leads; 0.3 in Pin Spacing; Value: 1uF
C5 C6 C12 C33-C42 CA01 CA1 CA02 CA2 CA11 CA12 CA21 CA22 Crx Cvmid = Cap-Bipolar: Bipolar Capacitor; Voltage: 100V; Designer: Saeid Jorablo; Organazation: ControTec; Adding Date: 1387/12/20
  C5: Value: 4.7uF
  C6 C38: Value: 0.1uF
  C12 C33 C34 C36 CA1 CA2 Crx Cvmid: Value: 100nF
  C35 C37: Value: 10uF
  C39-C41: Value: 22uF
  C42: Value: 10pF
  CA01 CA02 CA21 CA22: Value: 120pf
  CA11 CA12: Value: 47pf
C11 = Cap-Bipolar: Bipolar Capacitor; Designer: Saeid Jorablo; Organazation: ControTec; Voltage: 100V; Adding Date: 1387/12/20; Value: 100uF
C13-C25 CA5 = Cap-Bipolar: SMD Capacitor; Voltage: 100V; Designer: Saeid Jorablo; Organazation: ControTec; Adding Date: 1387/12/20
  C13 C17: Value: 33pF
  C14-C16 C20-C25 CA5: Value: 100nF
  C18 C19: Value: 2.2uF
D1 D2 = Diode 1N4148: High Conductance Fast Diode; Published: 8-Jun-2000; LatestRevisionDate: 17-Jul-2002; LatestRevisionNote: Re-released for DXP Platform.; DatasheetVersion: 1997; PackageReference: DO-35; Publisher: Altium Limited; PackageDescription: Diode, Axial; Body 3.8 x 1.9 mm (LxDia. max), Lead Dia. 0.53 mm (max); Code_JEDEC: DO-204-AH; ComponentLink1Description: Manufacturer Link; ComponentLink1URL: http://www.fairchildsemi.com/; ComponentLink2Description: Datasheet; ComponentLink2URL: http://www.fairchildsemi.com/ds/1N%2F1N4148.pdf
JP1 JP2 = Jumper: Company: E.P.I.L; Defualt State: Close; Design Date: 2011/11/02
L01 L1 L02 = Inductor: Code_IEC: 1005; Published: 8-Jun-2000; LatestRevisionDate: 29-May-2009; LatestRevisionNote: IPC-7351 Footprint Added.; PackageReference: 0402-A; Publisher: Altium Limited; PackageDescription: Chip Inductor; Code_JEITA: 0402
LED1 = LED: Designer: Saeid Jorablo; Organazation: ControTec; Adding Date: 1387/12/22; Color: Red; Size: SMD 1206
MicroSD1 = MicroSD Socket: MicroSD
P1 = 09 18 106 9421: Flat Cable Connector (IDC), PCB Transition Connector, 2 Rows, Kinked Solder Pin, 6 Contacts; PCB_Layout: Complies with manufacturer's recommendation.; DrillSize: Corresponds to nominal value.; Published: 15-Nov-2004; PackageDocument: 16-Sep-2003; PackageReference: 9181069421; Publisher: Altium Limited; ComponentLink1Description: Manufacturer Link; ComponentLink1URL: http://www.harting.com/; ComponentLink2Description: Packaging Specification; ComponentLink2URL: http://www.harkis.harting.com/_sek/pdf/TB_09181069421_BL01_R31541.pdf
P2 = Header 2: Header, 2-Pin; LatestRevisionDate: 17-Jul-2002; LatestRevisionNote: Re-released for DXP Platform.; Publisher: Altium Limited
Q1-Q12 Q15 Q22 = NPN: NPN Bipolar Transistor; Published: 8-Jun-2000; LatestRevisionDate: 29-May-2009; LatestRevisionNote: IPC-7351 Footprint Added.; PackageVersion: Aug-1999; PackageReference: SOT-23B; Publisher: Altium Limited; PackageDescription: 3-Pin SOT-23 Package 0.95 mm Pitch, 2.4 mm Lead Span
Q13 Q14 = FDN360P: P-Channel 30V 2A (Ta) 500mW (Ta) Surface Mount SuperSOT-3; MF: ON Semiconductor; Check_prices: https://www.snapeda.com/parts/FDN360P/ON%20Semiconductor/view-part/2105995/?ref=eda; MP: FDN360P; Price: None; Purchase-URL: https://pricing.snapeda.com/search/part/FDN360P/?ref=eda; Availability: Good; Package: SC-59 ON Semiconductor; SnapEDA_Link: https://www.snapeda.com/parts/FDN360P/ON%20Semiconductor/view-part/2105995/?ref=snap; Value: *
R1-R31 R50 R51 RJ1-RJ5 = Resistor: SMD Resistor; Tolerance: 5%; Power: 1/8 W
  R1-R20 R24 R50 R51: Value: 1K
  R25-R27 R29 R30: Value: 47K
  R28 RJ1-RJ5: Value: 10K
R34-R46 = Resistor: Tolerance: 5%; Power: 1/8 W
  R34-R41: Value: 1K
  R42 R43: Value: 1.5K
  R44 R45: Value: 1M
  R46: Value: 200K
Ra1 Ra2 RAX1 RAX2 = Resistor
  Ra1 Ra2: Value: 2.2
  RAX1 RAX2: Value: 1K
S1 = Switch PB: Push Button Switch
SW1-SW48 = Tactile_Switch
U1 = MFRC52201HN1,115: RFID Reader IC 13.56MHz ISO 14443, MIFARE IÂ²C, SPI, UART 2.5V ~ 3.3V 32-VFQFN Exposed Pad; MF: NXP USA; Value: *; Package: HVQFN-32 NXP Semiconductors; Price: None; MP: MFRC52201HN1,115; Availability: Unavailable; SnapEDA_Link: https://www.snapeda.com/parts/MFRC52201HN1,115/NXP%20USA%20Inc./view-part/564267/?ref=snap
U2 = ESP8266_Component
U3 = STM32F407VGT6: ARM Cortex-M4 32b MCU+FPU, 210DMIP, 1024 kB Flash, 192+4 kB RAM, Camera, 82 I/Os, 100-pin LQFP, -40 to +85°C, Tray; Internal RAM: 192kB; Operating Frequency (Processor Speed): 168MHz; A/D Converter: 16x12-bit; D/A Converter: 2x12-bit; 16-bit Timers (IC/OC/PWM): 12x16-bit(24/24/30); 32-bit Timer (IC/OC/PWM): 2x32-bit (8/8/8); Other Timer Functions: 2xWDG, RTC, 24-bit down counter; Serial Interface: 3xSPI/2xI2S/2xI2C/3xUSART(IrDa, ISO7816)/3xUART/2xUSB OTG FS/HS, 2xCAN/Ethernet MAC10/100, SDIO; DatasheetVersion: rev2, Jan-2012; PackageVersion: 2012; PackageReference: LQFP100; PackageDescription: 100-Pin Low Profile Quad Flat Package, 14x14 mm Body, 0.5 mm Pitch; ComponentLink1Description: Manufacturer URL; ComponentLink1URL: http://www.st.com/; ComponentLink2Description: STM32F405/7 Datasheet; ComponentLink2URL: http://www.st.com/internet/com/TECHNICAL_RESOURCES/TECHNICAL_LITERATURE/DATASHEET/DM00037051.pdf; ComponentLink3Description: STM32F4 Web Page; ComponentLink3URL: http://www.st.com/internet/mcu/subclass/1521.jsp
U4 = LCD_2_4_KavirElec
U5 = USB mini: mini USB Connector
U6 U7 = SN74LVC1G17DCKR: Single Schmitt-Trigger Buffer 5-SC70 -40 to 125; MF: Texas Instruments; Package: SOT-SC70-5 Texas Instruments; Value: *; MP: SN74LVC1G17DCKR; SnapEDA_Link: https://www.snapeda.com/parts/SN74LVC1G17DCKR/Texas%20Instruments/view-part/294145/?ref=snap; Texas_Instruments-Purchase-URL: https://snapeda.com/shop?store=Texas+Instruments&id=294145; BuyPart: https://www.snapeda.com/parts/SN74LVC1G17DCKR/Texas%20Instruments/view-part/294145/?ref=eda
U8 = 74HC74D,653: Flip Flop 2 Element D-Type 1 Bit Positive Edge 14-SOIC (0.154, 3.90mm Width); MF: Nexperia USA Inc.; Check_prices: https://www.snapeda.com/parts/74HC74D,653/Nexperia/view-part/5475836/?ref=eda; Value: *; SnapEDA_Link: https://www.snapeda.com/parts/74HC74D,653/Nexperia/view-part/5475836/?ref=snap; Availability: Good; Package: None; Purchase-URL: https://pricing.snapeda.com/search/part/74HC74D,653/?ref=eda; Price: None; MP: 74HC74D,653
U9 = TPS63060DSCR: Buck-Boost Switching Regulator IC Positive Adjustable 2.5V 1 Output 2A _Switch_ 10-WFDFN Exposed Pad; MF: Texas Instruments; Price: None; SnapEDA_Link: https://www.snapeda.com/parts/TPS63060DSCR/Texas%20Instruments/view-part/448588/?ref=snap; MP: TPS63060DSCR; Availability: Unavailable; Value: *; Package: WSON-10 Texas Instruments
U10 = LTC1733EMSE: Charger IC Lithium-Ion 10-MSOP-EP; MF: Linear Technology; MP: LTC1733EMSE; SnapEDA_Link: https://www.snapeda.com/parts/LTC1733EMSE/Analog%20Devices/view-part/108039/?ref=snap; Price: None; Package: MSOP-10 Linear Technology; Value: *; Availability: Unavailable
X1 Y1 = XTAL: XTAL Crystal; Company: E.P.I.L; Design Date: 11/04/2011
  X1: Value: 8 MHz
  Y1: Value: 11.0592 MHz